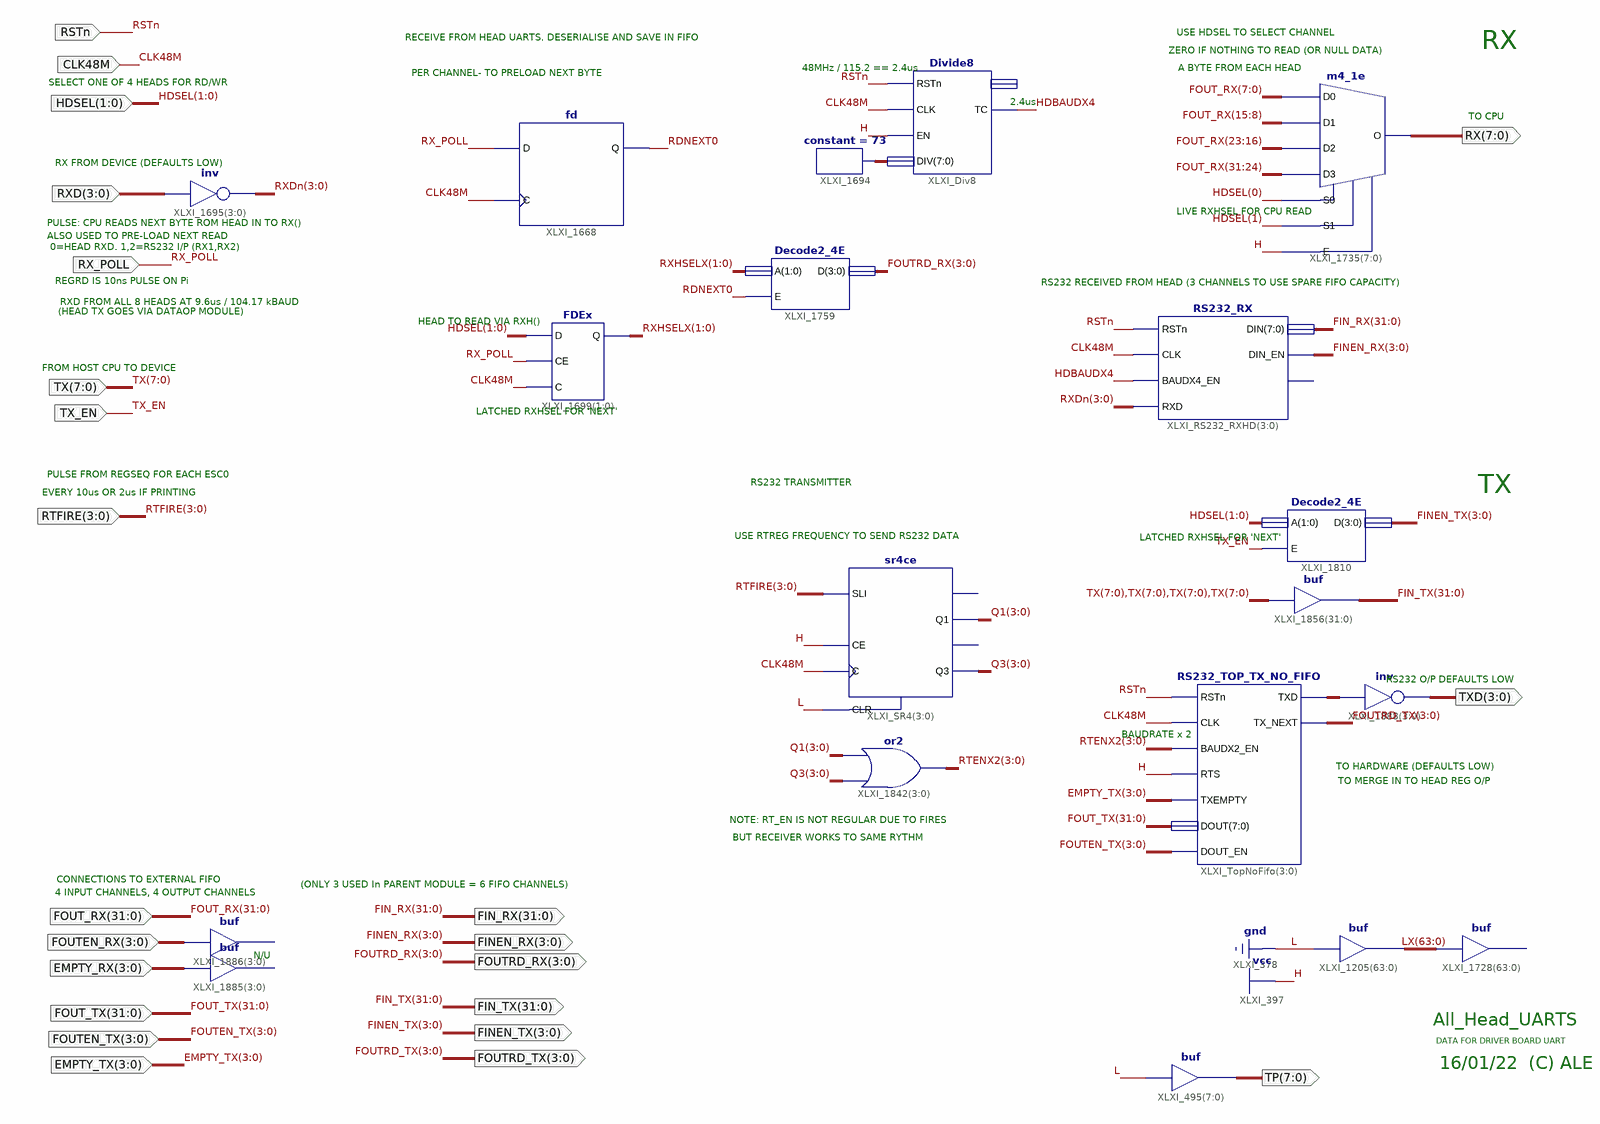
[diagram p0: schematic sheet 1]
// Xilinx ISE schematic All_Head_UARTS.sch (spartan3e) as structural Verilog: 19 symbols, 23 ports
module All_Head_UARTS (
  input  CLK48M,
  input  RSTn,
  input  TX_EN,
  input  [1:0] HDSEL,
  input  RX_POLL,
  input  [3:0] RTFIRE,
  input  [3:0] EMPTY_TX,
  input  [31:0] FOUT_TX,
  input  [3:0] FOUTEN_TX,
  input  [31:0] FOUT_RX,
  input  [3:0] FOUTEN_RX,
  input  [3:0] EMPTY_RX,
  input  [3:0] RXD,
  input  [7:0] TX,
  output [7:0] TP,
  output [7:0] RX,
  output [3:0] FOUTRD_TX,
  output [31:0] FIN_TX,
  output [3:0] FINEN_TX,
  output [31:0] FIN_RX,
  output [3:0] FINEN_RX,
  output [3:0] FOUTRD_RX,
  output [3:0] TXD
);

  wire HDBAUDX4, RDNEXT0;
  wire [1:0] RXHSELX;
  wire [3:0] Q1, Q3, RTENX2, RXDn, XLXN_2255;
  wire [7:0] XLXN_2253;
  wire [63:0] LX;

  assign TP = {8{1'b0}};  // buf XLXI_495[7..0], 8 bits wide
  assign LX = {64{1'b0}};  // buf XLXI_1205[63..0], 64 bits wide
  // buf XLXI_1728[63..0] has open pins: I=LX, O=open
  m4_1e XLXI_1735[7:0] (
    .D0(FOUT_RX[7:0]), .D1(FOUT_RX[15:8]), .D2(FOUT_RX[23:16]), .D3(FOUT_RX[31:24]), .E(1'b1), .S0(HDSEL[0]),
    .S1(HDSEL[1]), .O(RX));
  Decode2_4E XLXI_1810 (.A(HDSEL), .D(FINEN_TX), .E(TX_EN));
  assign FIN_TX = {TX, TX, TX, TX};  // buf XLXI_1856[31..0], 32 bits wide
  sr4ce XLXI_SR4[3:0] (.C(CLK48M), .CE(1'b1), .CLR(1'b0), .SLI(RTFIRE), .Q1(Q1), .Q3(Q3));  // open: Q0, Q2
  assign RTENX2 = Q3 | Q1;  // or2 XLXI_1842[3..0], 4 bits wide
  FDEx XLXI_1699[1:0] (.C(CLK48M), .CE(RX_POLL), .D(HDSEL), .Q(RXHSELX));
  RS232_RX XLXI_RS232_RXHD[3:0] (
    .BAUDX4_EN(HDBAUDX4), .CLK(CLK48M), .DIN(FIN_RX), .DIN_EN(FINEN_RX), .RSTn(RSTn), .RXD(RXDn));  // open: INHIBIT
  Decode2_4E XLXI_1759 (.A(RXHSELX), .D(FOUTRD_RX), .E(RDNEXT0));
  constant #(.CValue("73")) XLXI_1694 (.O(XLXN_2253));
  Divide8 XLXI_Div8 (.CLK(CLK48M), .DIV(XLXN_2253), .EN(1'b1), .RSTn(RSTn), .TC(HDBAUDX4));  // open: CUP
  fd XLXI_1668 (.C(CLK48M), .D(RX_POLL), .Q(RDNEXT0));
  // buf XLXI_1885[3..0] has open pins: I=EMPTY_RX, O=open
  // buf XLXI_1886[3..0] has open pins: I=FOUTEN_RX, O=open
  assign RXDn = ~RXD;  // inv XLXI_1695[3..0], 4 bits wide
  RS232_TOP_TX_NO_FIFO XLXI_TopNoFifo[3:0] (
    .BAUDX2_EN(RTENX2), .CLK(CLK48M), .DOUT(FOUT_TX), .DOUT_EN(FOUTEN_TX), .RSTn(RSTn), .RTS(1'b1),
    .TXD(XLXN_2255), .TXEMPTY(EMPTY_TX), .TX_NEXT(FOUTRD_TX));
  assign TXD = ~XLXN_2255;  // inv XLXI_1888[3..0], 4 bits wide

  // Notes on the sheet:
  //   USE HDSEL TO SELECT CHANNEL
  //   RECEIVE FROM HEAD UARTS. DESERIALISE AND SAVE IN FIFO
  //   RX
  //   ZERO IF NOTHING TO READ (OR NULL DATA)
  //   48MHz / 115.2 == 2.4us
  //   A BYTE FROM EACH HEAD
  //   PER CHANNEL- TO PRELOAD NEXT BYTE
  //   SELECT ONE OF 4 HEADS FOR RD/WR
  //   2.4us
  //   TO CPU
  //   RX FROM DEVICE (DEFAULTS LOW)
  //   LIVE RXHSEL FOR CPU READ
  //   PULSE: CPU READS NEXT BYTE ROM HEAD IN TO RX()
  //   ALSO USED TO PRE-LOAD NEXT READ
  //   0=HEAD RXD. 1,2=RS232 I/P (RX1,RX2)
  //   REGRD IS 10ns PULSE ON Pi
  //   RS232 RECEIVED FROM HEAD (3 CHANNELS TO USE SPARE FIFO CAPACITY)
  //   RXD FROM ALL 8 HEADS AT 9.6us / 104.17 kBAUD
  //   (HEAD TX GOES VIA DATAOP MODULE)
  //   HEAD TO READ VIA RXH()
  //   FROM HOST CPU TO DEVICE
  //   LATCHED RXHSEL FOR 'NEXT'
  //   PULSE FROM REGSEQ FOR EACH ESC0
  //   RS232 TRANSMITTER
  //   TX
  //   EVERY 10us OR 2us IF PRINTING
  //   USE RTREG FREQUENCY TO SEND RS232 DATA
  //   LATCHED RXHSEL FOR 'NEXT'
  //   RS232 O/P DEFAULTS LOW
  //   BAUDRATE x 2
  //   TO HARDWARE (DEFAULTS LOW)
  //   TO MERGE IN TO HEAD REG O/P
  //   NOTE: RT_EN IS NOT REGULAR DUE TO FIRES
  //   BUT RECEIVER WORKS TO SAME RYTHM
  //   CONNECTIONS TO EXTERNAL FIFO
  //   (ONLY 3 USED In PARENT MODULE = 6 FIFO CHANNELS)
  //   4 INPUT CHANNELS, 4 OUTPUT CHANNELS
  //   N/U
  //   All_Head_UARTS
  //   DATA FOR DRIVER BOARD UART
  //   16/01/22  (C) ALE
endmodule
